# Altium schematic sheet MCU.SchDoc: Name project title here
size A3; Organization: Krakul OÜ; Address1: Kaare tee 3, lubja; Address2: viimsi vald; Address3: harju maakond; Address4: Estonia 74010; DocumentNumber: No here; Revision: 0; SheetNumber: 5; SheetTotal: 7
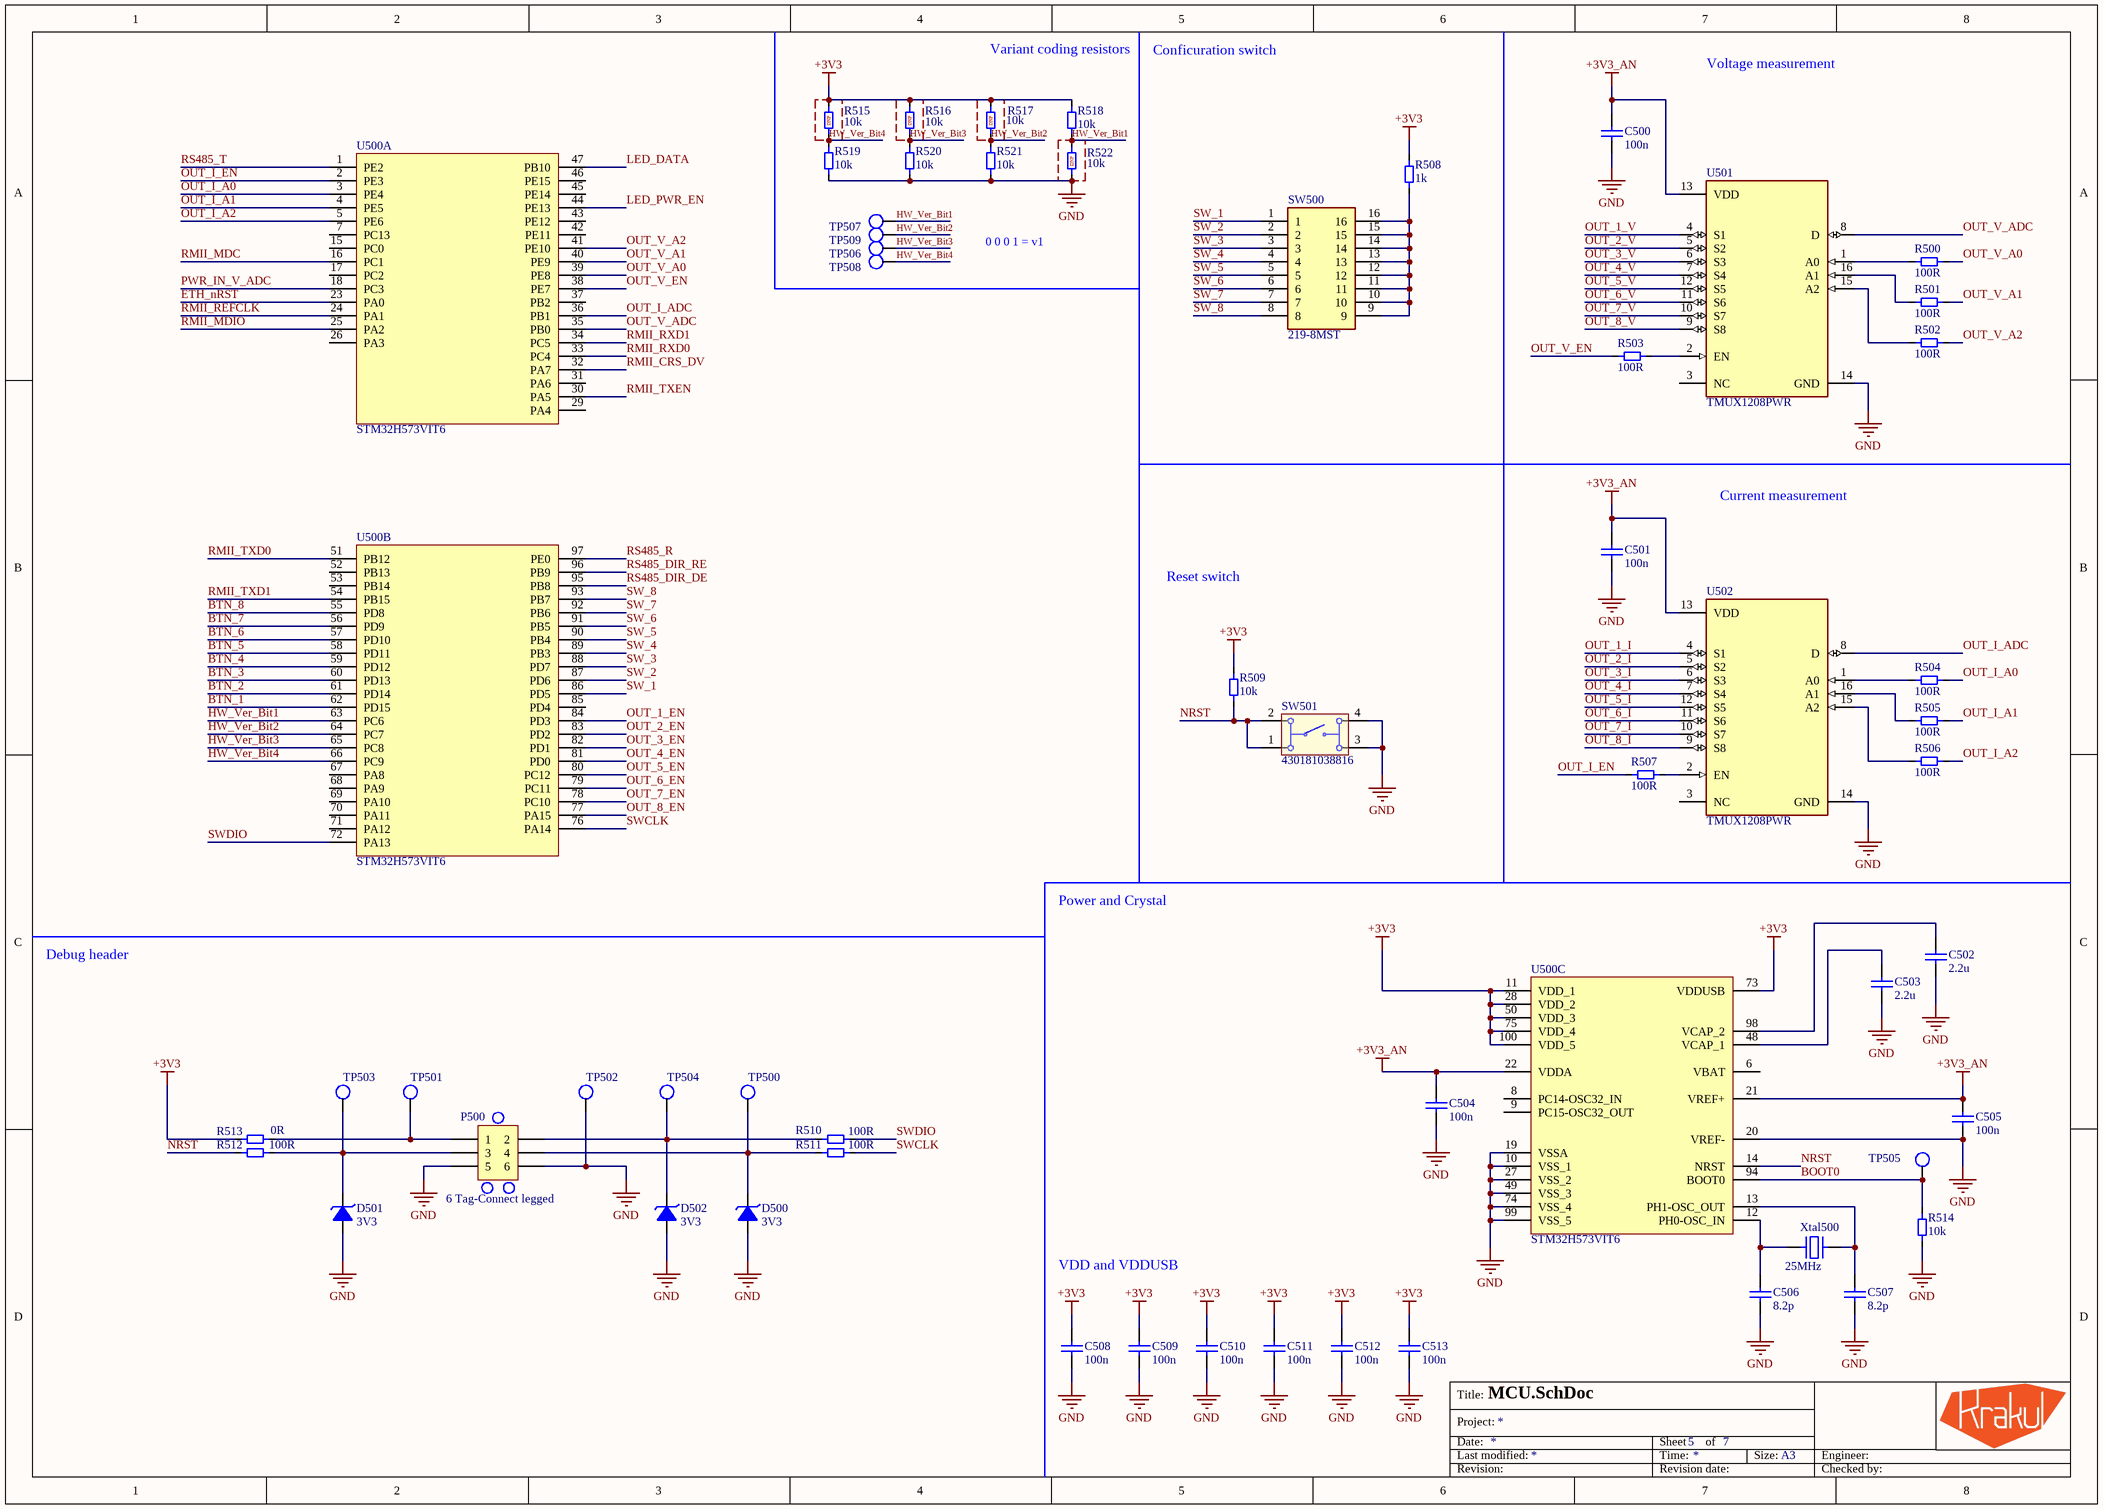
[diagram p0: MCU.SchDoc]

## Parts
C500  100n  [MLCC_0402_M]
C501  100n  [MLCC_0402_M]
C502  2.2u  [MLCC_0603_M]
C503  2.2u  [MLCC_0603_M]
C504  100n  [MLCC_0402_M]
C505  100n  [MLCC_0402_M]
C506  8.2p  [MLCC_0402_M]
C507  8.2p  [MLCC_0402_M]
C508  100n  [MLCC_0402_M]
C509  100n  [MLCC_0402_M]
C510  100n  [MLCC_0402_M]
C511  100n  [MLCC_0402_M]
C512  100n  [MLCC_0402_M]
C513  100n  [MLCC_0402_M]
D500  3V3  [SOD-923]
D501  3V3  [SOD-923]
D502  3V3  [SOD-923]
P500  6 Tag-Connect legged  [6P TAG-CONN legged]
R500  100R  [Resistor_0603_M]
R501  100R  [Resistor_0603_M]
R502  100R  [Resistor_0603_M]
R503  100R  [Resistor_0603_M]
R504  100R  [Resistor_0603_M]
R505  100R  [Resistor_0603_M]
R506  100R  [Resistor_0603_M]
R507  100R  [Resistor_0603_M]
R508  1k  [Resistor_0603_M]
R509  10k  [Resistor_0603_M]
R510  100R  [Resistor_0603_M]
R511  100R  [Resistor_0603_M]
R512  100R  [Resistor_0603_M]
R513  Value 2: 0R  [TLRZ2BTTD-Footprint-1]  (hidden comment: TLRZ2BTTD)
R514  10k  [Resistor_0603_M]
R515  10k  [Resistor_0603_M]
R516  10k  [Resistor_0603_M]
R517  10k  [Resistor_0603_M]
R518  10k  [Resistor_0603_M]
R519  10k  [Resistor_0603_M]
R520  10k  [Resistor_0603_M]
R521  10k  [Resistor_0603_M]
R522  10k  [Resistor_0603_M]
SW500  219-8MST  [219-8MST-Footprint-1]
SW501  430181038816  [430181038816]
TP500  Testpoint 1mm  [Testpoint 1mm]  (value not drawn)  (no BOM)
TP501  Testpoint 1mm  [Testpoint 1mm]  (value not drawn)  (no BOM)
TP502  Testpoint 1mm  [Testpoint 1mm]  (value not drawn)  (no BOM)
TP503  Testpoint 1mm  [Testpoint 1mm]  (value not drawn)  (no BOM)
TP504  Testpoint 1mm  [Testpoint 1mm]  (value not drawn)  (no BOM)
TP505  Testpoint 1mm  [Testpoint 1mm]  (value not drawn)  (no BOM)
TP506  Testpoint 1mm  [Testpoint 1mm]  (value not drawn)  (no BOM)
TP507  Testpoint 1mm  [Testpoint 1mm]  (value not drawn)  (no BOM)
TP508  Testpoint 1mm  [Testpoint 1mm]  (value not drawn)  (no BOM)
TP509  Testpoint 1mm  [Testpoint 1mm]  (value not drawn)  (no BOM)
U500  STM32H573VIT6  [STM32H573VIT6-Footprint-1]  (parts A,B,C of 3)
U501  TMUX1208PWR  [FP-PW0016A-IPC_B]
U502  TMUX1208PWR  [FP-PW0016A-IPC_B]
Xtal500  Frequency: 25MHz  [4-SMD Crystal 2.00mm x 1.60mm]  (hidden comment: ECS-250-10-37B-CTN-TR)

## Nets
+3V3: C508.2 C509.2 C510.2 C511.2 C512.2 C513.2 R508.2 R509.2 R513.2 R515.1 R516.2 R517.2 R518.2 U500.11(VDD_1) U500.28(VDD_2) U500.50(VDD_3) U500.73(VDDUSB) U500.75(VDD_4) U500.100(VDD_5)
+3V3_AN: C500.2 C501.2 C504.2 C505.2 U500.21(VREF+) U500.22(VDDA) U501.13(VDD) U502.13(VDD)
GND: C500.1 C501.1 C502.1 C503.1 C504.1 C505.1 C506.1 C507.1 C508.1 C509.1 C510.1 C511.1 C512.1 C513.1 D500.2(A) D501.2(A) D502.2(A) P500.5 P500.6 R514.1 R519.1 R520.1 R521.1 R522.1 SW501.3 SW501.4 TP502.1 U500.10(VSS_1) U500.19(VSSA) U500.20(VREF-) U500.27(VSS_2) U500.49(VSS_3) U500.74(VSS_4) U500.99(VSS_5) U501.14(GND) U502.14(GND) Xtal500.2(GND) Xtal500.4(GND)
BOOT0: R514.2 TP505.1 U500.94(BOOT0)
BTN_1: U500.62(PD15)
BTN_2: U500.61(PD14)
BTN_3: U500.60(PD13)
BTN_4: U500.59(PD12)
BTN_5: U500.58(PD11)
BTN_6: U500.57(PD10)
BTN_7: U500.56(PD9)
BTN_8: U500.55(PD8)
ETH_nRST: U500.23(PA0)
HW_Ver_Bit1: R518.1 R522.2 TP507.1 U500.63(PC6)
HW_Ver_Bit2: R517.1 R521.2 TP509.1 U500.64(PC7)
HW_Ver_Bit3: R516.1 R520.2 TP506.1 U500.65(PC8)
HW_Ver_Bit4: R515.2 R519.2 TP508.1 U500.66(PC9)
LED_DATA: U500.47(PB10)
LED_PWR_EN: U500.44(PE13)
NRST: R509.1 R512.2 SW501.1 SW501.2 U500.14(NRST)
OUT_1_EN: U500.84(PD3)
OUT_1_I: U502.4(S1)
OUT_1_V: U501.4(S1)
OUT_2_EN: U500.83(PD2)
OUT_2_I: U502.5(S2)
OUT_2_V: U501.5(S2)
OUT_3_EN: U500.82(PD1)
OUT_3_I: U502.6(S3)
OUT_3_V: U501.6(S3)
OUT_4_EN: U500.81(PD0)
OUT_4_I: U502.7(S4)
OUT_4_V: U501.7(S4)
OUT_5_EN: U500.80(PC12)
OUT_5_I: U502.12(S5)
OUT_5_V: U501.12(S5)
OUT_6_EN: U500.79(PC11)
OUT_6_I: U502.11(S6)
OUT_6_V: U501.11(S6)
OUT_7_EN: U500.78(PC10)
OUT_7_I: U502.10(S7)
OUT_7_V: U501.10(S7)
OUT_8_EN: U500.77(PA15)
OUT_8_I: U502.9(S8)
OUT_8_V: U501.9(S8)
OUT_I_A0: R504.2 U500.3(PE4)
OUT_I_A1: R505.2 U500.4(PE5)
OUT_I_A2: R506.2 U500.5(PE6)
OUT_I_ADC: U500.36(PB1) U502.8(D)
OUT_I_EN: R507.1 U500.2(PE3)
OUT_V_A0: R500.2 U500.39(PE8)
OUT_V_A1: R501.2 U500.40(PE9)
OUT_V_A2: R502.2 U500.41(PE10)
OUT_V_ADC: U500.35(PB0) U501.8(D)
OUT_V_EN: R503.1 U500.38(PE7)
PWR_IN_V_ADC: U500.18(PC3)
RMII_CRS_DV: U500.32(PA7)
RMII_MDC: U500.16(PC1)
RMII_MDIO: U500.25(PA2)
RMII_REFCLK: U500.24(PA1)
RMII_RXD0: U500.33(PC4)
RMII_RXD1: U500.34(PC5)
RMII_TXD0: U500.51(PB12)
RMII_TXD1: U500.54(PB15)
RMII_TXEN: U500.30(PA5)
RS485_DIR_DE: U500.95(PB8)
RS485_DIR_RE: U500.96(PB9)
RS485_R: U500.97(PE0)
RS485_T: U500.1(PE2)
SW_1: SW500.1 U500.86(PD5)
SW_2: SW500.2 U500.87(PD6)
SW_3: SW500.3 U500.88(PD7)
SW_4: SW500.4 U500.89(PB3)
SW_5: SW500.5 U500.90(PB4)
SW_6: SW500.6 U500.91(PB5)
SW_7: SW500.7 U500.92(PB6)
SW_8: SW500.8 U500.93(PB7)
SWCLK: R511.1 U500.76(PA14)
SWDIO: R510.2 U500.72(PA13)
NetC502_2: C502.2 U500.98(VCAP_2)
NetC503_2: C503.2 U500.48(VCAP_1)
NetC506_2: C506.2 U500.12(PH0-OSC_IN) Xtal500.1
NetC507_2: C507.2 U500.13(PH1-OSC_OUT) Xtal500.3
NetD500_1: D500.1(C) P500.4 R511.2 TP500.1
NetD501_1: D501.1(C) P500.3 R512.1 TP503.1
NetD502_1: D502.1(C) P500.2 R510.1 TP504.1
NetP500_1: P500.1 R513.1 TP501.1
NetR500_1: R500.1 U501.1(A0)
NetR501_1: R501.1 U501.16(A1)
NetR502_1: R502.1 U501.15(A2)
NetR503_2: R503.2 U501.2(EN)
NetR504_1: R504.1 U502.1(A0)
NetR505_1: R505.1 U502.16(A1)
NetR506_1: R506.1 U502.15(A2)
NetR507_2: R507.2 U502.2(EN)
NetR508_1: R508.1 SW500.9 SW500.10 SW500.11 SW500.12 SW500.13 SW500.14 SW500.15 SW500.16

Not connected (* = marked no-connect by the designer): U500 6(VBAT) 7(PC13) 8(PC14-OSC32_IN) 9(PC15-OSC32_OUT) 15(PC0) 17(PC2) 26(PA3) 29(PA4) 31(PA6) 37(PB2) 42(PE11) 43(PE12) 45(PE14) 46(PE15) 52(PB13) 53(PB14) 67(PA8) 68(PA9) 69(PA10) 70(PA11) 71(PA12) 85(PD4); U501 3(NC); U502 3(NC)

## Notes on the sheet
- Variant coding resistors
- Conficuration switch
- Voltage measurement
- (near R515) DNP
- (near R516) DNP
- (near R517) DNP
- (near R522) DNP
- 0 0 0 1 = v1
- Current measurement
- Reset switch
- Power and Crystal
- Debug header
- VDD and VDDUSB
- Title:
- Date:
- Last modified:
- Project:
- Sheet
- Time:
- of
- Size:
- A3
- Engineer:
- Revision:
- Revision date:
- Checked by:

## Library data of the parts
C500 C501 C504 C505 C508-C513 = CMP-001-1256-2: MLCC, 0402, 100n, 10%, 10V, X5R; Manufacturer: Any; Capacitor Type: Ceramic; Value: 100nF; Case/Package: 0402; Part number: MLCC, 0402, 100n, 10%, 10V, X5R; RoHS: Yes; Tolerance: 10%; Mount: SMD; Voltage: 10V; Dielectric: X5R
C502 C503 = CMP-001-1459-1: MLCC, 0603, 2.2u, 10%, 16V, X5R; Manufacturer: Any; Capacitor Type: Ceramic; Value: 2.2µF; RoHS: Yes; Dielectric: X5R; Part number: MLCC, 0603, 2.2u, 10%, 16V, X5R; Case/Package: 0603; Tolerance: 10%; Voltage: 16V; Mount: SMD
C506 C507 = CMP-0001-00091-2: MLCC, 0402, 8.2p, 5%, 50V, C0G/NP0; Manufacturer: Any; Value: 8.2pF; Capacitor Type: Ceramic; Part number: MLCC, 0402, 8.2p, 5%, 50V, C0G/NP0; Voltage: 50V; Mount: SMD; Tolerance: 5%; Case/Package: 0402; RoHS: Yes; Dielectric: C0G/NP0
D500-D502 = CMP-001-1298-2: TVS DIODE 3.3V SOD923; Part number: ESD9X3.3ST5G; Manufacturer: ON Semiconductor; Number of Channels: 1; Polarity: Unidirectional; Clamping Voltage: 10.4V; Test Current: 1mA; Element Configuration: Single; Max Power Dissipation: 150mW; Peak Pulse Current: 9.8A; Max Breakdown Voltage: 5V; Capacitance: 80pF; Leakage Current: 2.5uA; Peak Pulse Power: 102W; ESD Protection: Yes; Power Line Protection: No; Operating Supply Voltage: 3.3V; Packaging: Tape and Reel; Working Voltage: 3.3V; Direction: Unidirectional; Width: 0.65mm; Number of Pins: 2; Max Operating Temperature: 150°C; REACH SVHC: No SVHC; Length: 0.8mm; Halogen Free: Halogen Free; Package Quantity: 1; Mount: Surface Mount; Number of Lines: 1; Number of Unidirectional Channels: 1; Pins: 2; Contact Plating: Tin,Matte; Depth: 0.6mm; Termination: SMD/SMT; Lead Free: Lead Free; Reverse Standoff Voltage: 3.3V; Min Operating Temperature: -55°C; Composition: Zener; RoHS: Yes; Case/Package: SOD-923-2; Reverse Breakdown Voltage: 5V; Max Surge Current: 9.8A; Number of Elements: 1; Height: 0.43mm; Breakdown Voltage: 5V; Radiation Hardening: No; Min Breakdown Voltage: 5V; Max Reverse Leakage Current: 2.5uA; Number of Circuits: 1
P500 = CMP-001-1441-5: 6 Pin Tag-Connect legged; Manufacturer: Tag-Connect; RoHS: Yes; Mount: TH; Part number: 6pin Tag-Connect legged
R500-R507 R510-R512 = CMP-001-0053-3: Resistor, 0603, 100R, 1%, 1/10W; Manufacturer: Any; Value: 100; Power: 100mW; RoHS: Yes; Case/Package: 0603; Tolerance: 1%; Part number: Resistor, 0603, 100R, 1%, 1/10W; Mount: SMD
R508 = CMP-0001-00237-1: Resistor, 0603, 1k, 0.1%, 1/16W; Manufacturer: Any; Mount: SMD; Part number: Any; RoHS: Yes; Case/Package: 0603; Value: 1k
R509 R514-R522 = CMP-001-0101-2: Resistor, 0603, 10k, 1%, 1/10W; Manufacturer: Any; Power: 100mW; Tolerance: 1%; Value: 10k; RoHS: Yes; Mount: SMD; Case/Package: 0603; Part number: Resistor, 0603, 10k, 1%, 1/10W
R513 = CMP-0001-00276-2: Res Metal Plate 1206 0 Ohm Sulfur Resistant Pad SMD Automotive T/R; Manufacturer: KOA Speer Electronics; Current: 50A; Value: 0; Case/Package: 1206; Mount: SMD; Part number: TLRZ2BTTD; Pins: 2; RoHS: Yes; Case Code (Imperial): 1206; Case Code (Metric): 3216; Features: Automotive AEC-Q200; Max Operating Temperature: 170°C; Min Operating Temperature: -55°C; Number of Terminations: 2; Packaging: Cut Tape; Ratings: AEC-Q200; RoHS Compliant: Yes; Series: TLRZ
SW500 = CMP-ROOT-01070-1: Switch DIP ON OFF SPST 8 Raised Slide 0.1A 20VDC Gull Wing 2000Cycles 2.54mm SMD Tube; Manufacturer: CTS Electronic Components; Actuator Length: 0.25mm; Actuator Type: Slide (Standard); Contact Resistance: 25mR; Current Rating: 100mA; Max Voltage Rating (DC): 20V; Number of Positions: 8; Washable: Yes; Case/Package: SMD; Mount: SMD; Part number: 219-8MST; Pins: 16; RoHS: Yes; Contact Material: Copper; Contact Plating: Gold,Tin; Depth: 9.91mm; Electrical Life: 2000Cycles; Height: 4.05mm; Lead Free: Lead Free; Length: 21.79mm; Max Current Rating: 100mA; Max Operating Temperature: 85°C; Mechanical Life: 2000Cycles; Min Operating Temperature: -55°C; Mounting Technology: Surface Mount; Orientation: Straight; Package Quantity: 25; Packaging: Rail/Tube; Radiation Hardening: No; RoHS Compliant: Yes; Series: 219; Terminal Pitch: 2.54mm; Termination: Gull Wing; Throw Configuration: SPST; Voltage Rating (DC): 20V
SW501 = CMP-ROOT-00883-1: Switch Tactile Spst-no 0.05A 12V; Manufacturer: Würth Elektronik; Case/Package: SMD; Part number: 430181038816; RoHS: Yes; Mount: Surface Mount
TP500-TP509 = CMP-001-1238-1
U500 = CMP-ROOT-01065-3: Armï¿½ Cortexï¿½-M33 32-bit MCU+TrusZoneï¿½ + FPU, 360 DMIPS @240MHz, 2 Mbytes Flash, 640 Kbytes RAM, Math accelerators; Manufacturer: STMicroelectronics; Case/Package: LQFP100; Mount: SMD; Part number: STM32H573VIT6; Pins: 100; RoHS: Yes
U501 U502 = CMP-ROOT-01067-2: 5-V, 8: 1, 1-channel general-purpose analog multiplexer with 1.8-V input logic 16-TSSOP -40 to 125; Manufacturer: TI; Case/Package: TSSOP-16; Mount: SMD; Part number: TMUX1208PWR; Pins: 16; RoHS: Yes
Xtal500 = CMP-001-1313-1: 25MHz ±10ppm Crystal 10pF 50 Ohms 4-SMD, No Lead; Manufacturer: ECS Inc.; Case/Package: 4-SMD 2.0x1.6; Part number: ECS-250-10-37B-CTN-TR; Pins: 4; Mount: SMD; RoHS: Yes